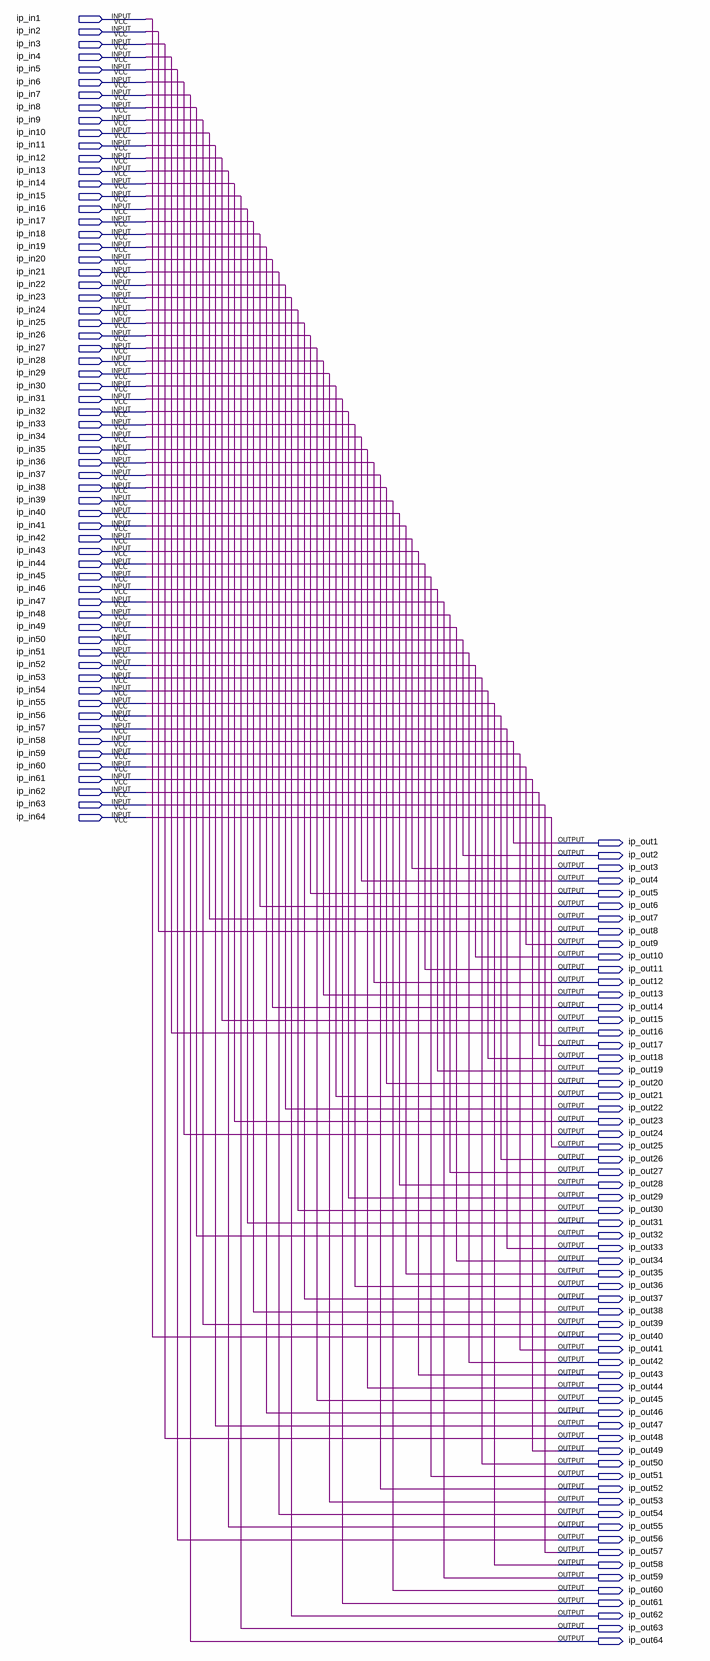
[diagram p0: schematic sheet]
// Quartus schematic IP.bdf as structural Verilog: 0 symbols, 128 pins
module IP (
  input  ip_in1,
  input  ip_in2,
  input  ip_in3,
  input  ip_in4,
  input  ip_in5,
  input  ip_in6,
  input  ip_in7,
  input  ip_in8,
  input  ip_in9,
  input  ip_in10,
  input  ip_in11,
  input  ip_in12,
  input  ip_in13,
  input  ip_in14,
  input  ip_in15,
  input  ip_in16,
  input  ip_in17,
  input  ip_in18,
  input  ip_in19,
  input  ip_in20,
  input  ip_in21,
  input  ip_in22,
  input  ip_in23,
  input  ip_in24,
  input  ip_in25,
  input  ip_in26,
  input  ip_in27,
  input  ip_in28,
  input  ip_in29,
  input  ip_in30,
  input  ip_in31,
  input  ip_in32,
  input  ip_in33,
  input  ip_in34,
  input  ip_in35,
  input  ip_in36,
  input  ip_in37,
  input  ip_in38,
  input  ip_in39,
  input  ip_in40,
  input  ip_in41,
  input  ip_in42,
  input  ip_in43,
  input  ip_in44,
  input  ip_in45,
  input  ip_in46,
  input  ip_in47,
  input  ip_in48,
  input  ip_in49,
  input  ip_in50,
  input  ip_in51,
  input  ip_in52,
  input  ip_in53,
  input  ip_in54,
  input  ip_in55,
  input  ip_in56,
  input  ip_in57,
  input  ip_in58,
  input  ip_in59,
  input  ip_in60,
  input  ip_in61,
  input  ip_in62,
  input  ip_in63,
  input  ip_in64,
  output ip_out1,
  output ip_out2,
  output ip_out3,
  output ip_out4,
  output ip_out5,
  output ip_out6,
  output ip_out7,
  output ip_out8,
  output ip_out9,
  output ip_out10,
  output ip_out11,
  output ip_out12,
  output ip_out13,
  output ip_out14,
  output ip_out15,
  output ip_out16,
  output ip_out17,
  output ip_out18,
  output ip_out19,
  output ip_out20,
  output ip_out21,
  output ip_out22,
  output ip_out23,
  output ip_out24,
  output ip_out25,
  output ip_out26,
  output ip_out27,
  output ip_out28,
  output ip_out29,
  output ip_out30,
  output ip_out31,
  output ip_out32,
  output ip_out33,
  output ip_out34,
  output ip_out35,
  output ip_out36,
  output ip_out37,
  output ip_out38,
  output ip_out39,
  output ip_out40,
  output ip_out41,
  output ip_out42,
  output ip_out43,
  output ip_out44,
  output ip_out45,
  output ip_out46,
  output ip_out47,
  output ip_out48,
  output ip_out49,
  output ip_out50,
  output ip_out51,
  output ip_out52,
  output ip_out53,
  output ip_out54,
  output ip_out55,
  output ip_out56,
  output ip_out57,
  output ip_out58,
  output ip_out59,
  output ip_out60,
  output ip_out61,
  output ip_out62,
  output ip_out63,
  output ip_out64
);


  assign ip_out1 = ip_in58;
  assign ip_out2 = ip_in50;
  assign ip_out3 = ip_in42;
  assign ip_out4 = ip_in34;
  assign ip_out5 = ip_in26;
  assign ip_out6 = ip_in18;
  assign ip_out7 = ip_in10;
  assign ip_out8 = ip_in2;
  assign ip_out9 = ip_in60;
  assign ip_out10 = ip_in52;
  assign ip_out11 = ip_in44;
  assign ip_out12 = ip_in36;
  assign ip_out13 = ip_in28;
  assign ip_out14 = ip_in20;
  assign ip_out15 = ip_in12;
  assign ip_out16 = ip_in4;
  assign ip_out17 = ip_in62;
  assign ip_out18 = ip_in54;
  assign ip_out19 = ip_in46;
  assign ip_out20 = ip_in38;
  assign ip_out21 = ip_in30;
  assign ip_out22 = ip_in22;
  assign ip_out23 = ip_in14;
  assign ip_out24 = ip_in6;
  assign ip_out25 = ip_in64;
  assign ip_out26 = ip_in56;
  assign ip_out27 = ip_in48;
  assign ip_out28 = ip_in40;
  assign ip_out29 = ip_in32;
  assign ip_out30 = ip_in24;
  assign ip_out31 = ip_in16;
  assign ip_out32 = ip_in8;
  assign ip_out33 = ip_in57;
  assign ip_out34 = ip_in49;
  assign ip_out35 = ip_in41;
  assign ip_out36 = ip_in33;
  assign ip_out37 = ip_in25;
  assign ip_out38 = ip_in17;
  assign ip_out39 = ip_in9;
  assign ip_out40 = ip_in1;
  assign ip_out41 = ip_in59;
  assign ip_out42 = ip_in51;
  assign ip_out43 = ip_in43;
  assign ip_out44 = ip_in35;
  assign ip_out45 = ip_in27;
  assign ip_out46 = ip_in19;
  assign ip_out47 = ip_in11;
  assign ip_out48 = ip_in3;
  assign ip_out49 = ip_in61;
  assign ip_out50 = ip_in53;
  assign ip_out51 = ip_in45;
  assign ip_out52 = ip_in37;
  assign ip_out53 = ip_in29;
  assign ip_out54 = ip_in21;
  assign ip_out55 = ip_in13;
  assign ip_out56 = ip_in5;
  assign ip_out57 = ip_in63;
  assign ip_out58 = ip_in55;
  assign ip_out59 = ip_in47;
  assign ip_out60 = ip_in39;
  assign ip_out61 = ip_in31;
  assign ip_out62 = ip_in23;
  assign ip_out63 = ip_in15;
  assign ip_out64 = ip_in7;
endmodule
